# Altium schematic sheet Sheet2.SchDoc: =GlobalProjectName
size 410 x 297 mm; ApprovedBy: Утвердил; CheckedBy: Проверил; Author: Разработал; SheetNumber: Лист; SheetTotal: 1; PageSetup: Record=PageOptions|CenterHorizontal=True|CenterVertical=True|PrintScale=1.00|XCorrection=1.00|YCorrection=1.00|PrintKind=1|BorderSize=5000000|LeftOffset=0|BottomOffset=0|Orientation=2|PaperLength=1000|PaperWidth=1000|Scale=100|PaperSource=15|PrintQuality=1200|MediaType=1|DitherType=10|PaperKind=A3|PrintScaleMode=1; Weight: -; ScaleFactor: -; NormInspection: Норм.Контр.; Time: Листов
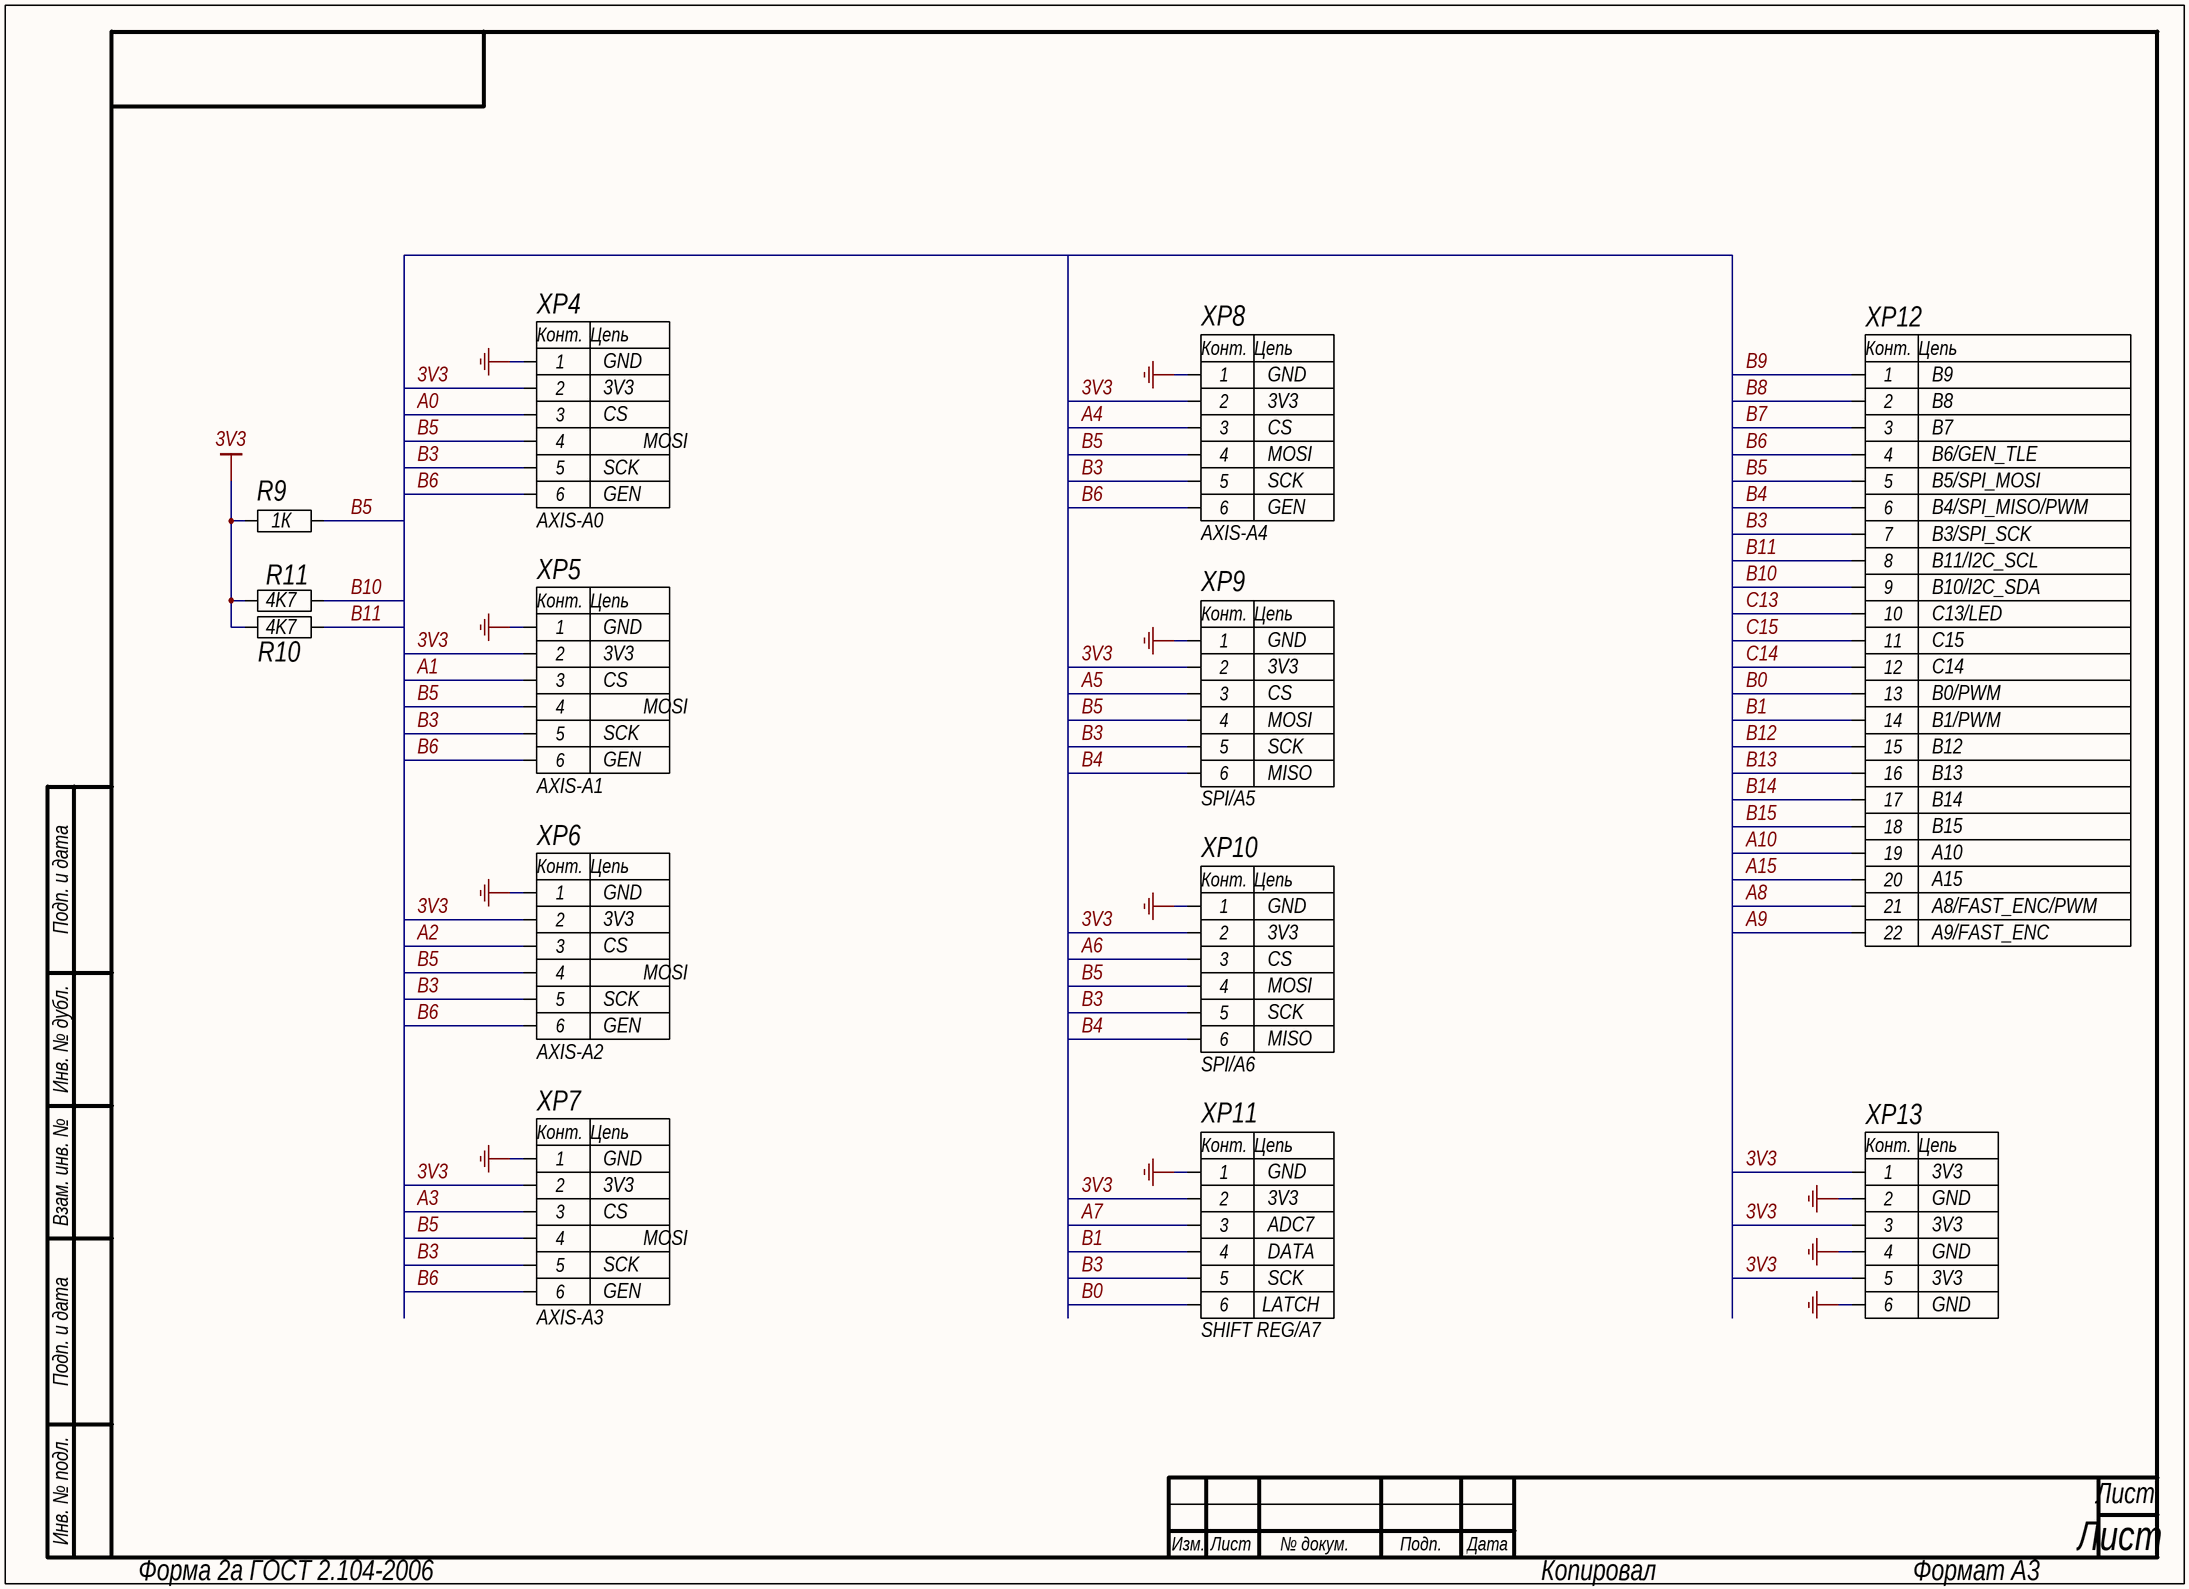
[diagram p0: Sheet2.SchDoc]

## Parts
R9  1К  [RC0603_HD]
R10  4K7  [RC0603_HD]
R11  4K7  [RC0603_HD]
XP4  AXIS-A0  [PH2.0-6P]
XP5  AXIS-A1  [PH2.0-6P]
XP6  AXIS-A2  [PH2.0-6P]
XP7  AXIS-A3  [PH2.0-6P]
XP8  AXIS-A4  [PH2.0-6P]
XP9  SPI/A5  [PH2.0-6P]
XP10  SPI/A6  [PH2.0-6P]
XP11  SHIFT REG/A7  [PH2.0-6P]
XP12  GPIO  [PLD-22]  (value not drawn)
XP13  SUPPLY  [PLD-6]  (value not drawn)

## Nets
3V3: R9.2 R10.1 R11.1 XP4.2 XP5.2 XP6.2 XP7.2 XP8.2 XP9.2 XP10.2 XP11.2 XP13.1 XP13.3 XP13.5
GND: XP4.1 XP5.1 XP6.1 XP7.1 XP8.1 XP9.1 XP10.1 XP11.1 XP13.2 XP13.4 XP13.6
A0: XP4.3
A1: XP5.3
A2: XP6.3
A3: XP7.3
A4: XP8.3
A5: XP9.3
A6: XP10.3
A7: XP11.3
A8: XP12.21
A9: XP12.22
A10: XP12.19
A15: XP12.20
B0: XP11.6 XP12.13
B1: XP11.4 XP12.14
B3: XP4.5 XP5.5 XP6.5 XP7.5 XP8.5 XP9.5 XP10.5 XP11.5 XP12.7
B4: XP9.6 XP10.6 XP12.6
B5: R9.1 XP4.4 XP5.4 XP6.4 XP7.4 XP8.4 XP9.4 XP10.4 XP12.5
B6: XP4.6 XP5.6 XP6.6 XP7.6 XP8.6 XP12.4
B7: XP12.3
B8: XP12.2
B9: XP12.1
B10: R11.2 XP12.9
B11: R10.2 XP12.8
B12: XP12.15
B13: XP12.16
B14: XP12.17
B15: XP12.18
C13: XP12.10
C14: XP12.12
C15: XP12.11

## Notes on the sheet
- 3V3
- GND
- B9
- CS
- MOSI
- B8
- B6/GEN_TLE
- B7
- SCK
- GEN
- B4/SPI_MISO/PWM
- B5/SPI_MOSI
- B3/SPI_SCK
- B10/I2C_SDA
- B11/I2C_SCL
- C15
- C13/LED
- C14
- B1/PWM
- B0/PWM
- MISO
- B12
- B13
- B14
- B15
- A10
- A8/FAST_ENC/PWM
- A15
- A9/FAST_ENC
- DATA
- ADC7
- LATCH
- Подп. и дата
- Инв. № дубл.
- Взам. инв. №
- Инв. № подл.
- Изм.
- Лист
- № докум.
- Подп.
- Дата
- Форма 2а ГОСТ 2.104-2006
- Копировал
- Формат А3
- (in symbol Вилка DS1021-2x3) Конт.; Цепь
- (in symbol Вилка DS1021-2x11) Конт.; Цепь
- (in symbol Вилка PH2.0-6P) Конт.; Цепь

## Library data of the parts
R9 = Резистор RC0603FR-071KL: 1K ± 1%, SMD 0603; Value: Резистор 0603
R10 R11 = Резистор RC0603FR-074K7L: 4K7 ± 1%, SMD 0603; Value: Резистор 0603
XP4-XP11 = Вилка PH2.0-6P: PH2.0-6P; Value: Гнездо PBS-12
XP12 = Вилка DS1021-2x11: PLD-22; Value: Вилка PLD-22
XP13 = Вилка DS1021-2x3: PLD-6; Value: Вилка PLD-6